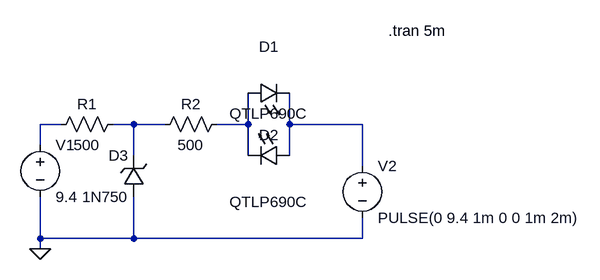
[diagram p0: schematic led-2.asc]
led-2.asc, the LTspice schematic file:
Version 4
SHEET 1 996 680
WIRE 192 304 160 304
WIRE 304 304 272 304
WIRE 352 304 304 304
WIRE 480 304 480 256
WIRE 480 304 432 304
WIRE 544 304 544 256
WIRE 656 304 544 304
WIRE 160 336 160 304
WIRE 304 352 304 304
WIRE 480 352 480 304
WIRE 544 352 544 304
WIRE 656 368 656 304
WIRE 160 480 160 416
WIRE 304 480 304 416
WIRE 304 480 160 480
WIRE 656 480 656 448
WIRE 656 480 304 480
WIRE 160 496 160 480
FLAG 160 496 0
SYMBOL LED 480 272 R270
WINDOW 0 72 32 VTop 2
WINDOW 3 0 32 VBottom 2
SYMATTR InstName D1
SYMATTR Value QTLP690C
SYMBOL LED 544 336 R90
WINDOW 0 0 32 VBottom 2
WINDOW 3 72 32 VTop 2
SYMATTR InstName D2
SYMATTR Value QTLP690C
SYMBOL voltage 656 352 R0
SYMATTR InstName V2
SYMATTR Value PULSE(0 9.4 1m 0 0 1m 2m)
SYMBOL voltage 160 320 R0
SYMATTR InstName V1
SYMATTR Value 9.4
SYMBOL res 288 288 R90
WINDOW 0 0 56 VBottom 2
WINDOW 3 32 56 VTop 2
SYMATTR InstName R1
SYMATTR Value 500
SYMBOL zener 320 416 R180
WINDOW 0 24 64 Left 2
WINDOW 3 24 0 Left 2
SYMATTR InstName D3
SYMATTR Value 1N750
SYMBOL res 448 288 R90
WINDOW 0 0 56 VBottom 2
WINDOW 3 32 56 VTop 2
SYMATTR InstName R2
SYMATTR Value 500
TEXT 696 160 Left 2 !.tran 5m

The netlist it stands for:
* led-2.asc
D1 N003 N004 QTLP690C
D2 N004 N003 QTLP690C
V2 N004 0 PULSE(0 9.4 1m 0 0 1m 2m)
V1 N001 0 9.4
R1 N002 N001 500
D3 0 N002 1N750
R2 N003 N002 500
.model D D
.lib standard.dio
.tran 5m
.backanno
.end